# Altium schematic sheet SENSE MUXES.SchDoc: =DocumentName
size B
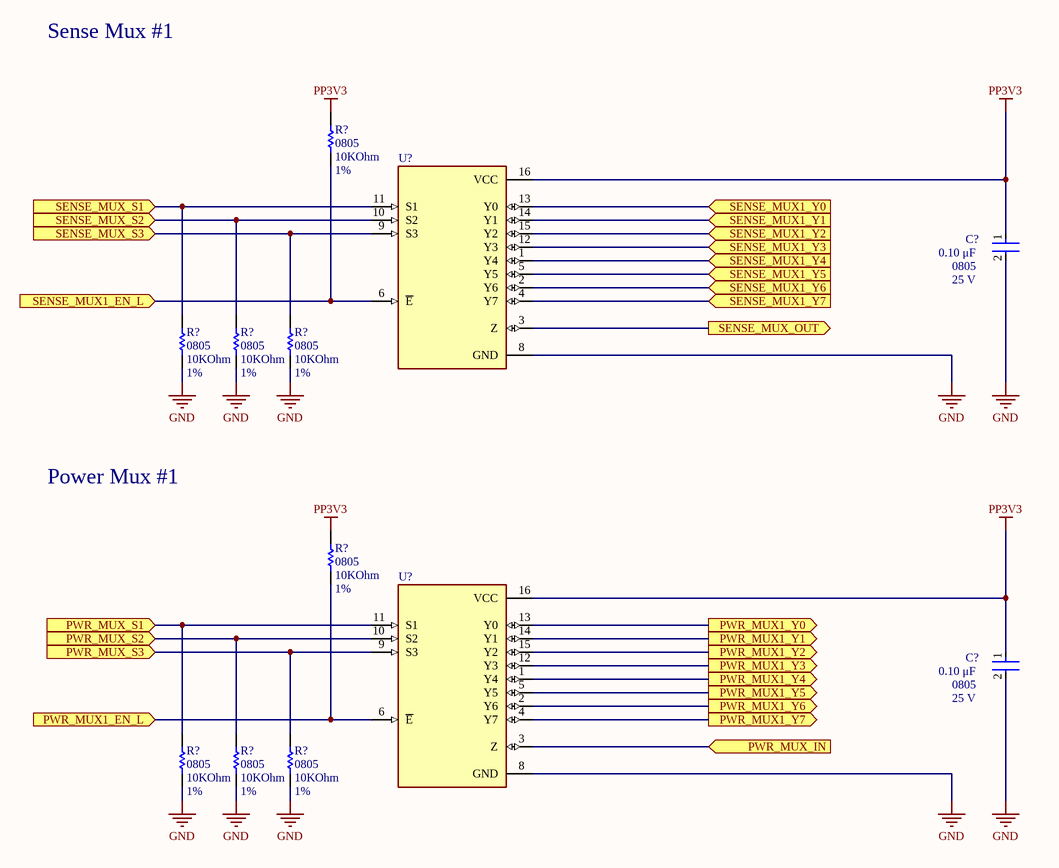
[diagram p0: SENSE MUXES.SchDoc]

## Parts
(Parts that share a designator on the sheet are numbered #1, #2 ... from top to bottom, then left to right.)
C?#1  Capacitance: 0.10 μF  Package: 0805  Voltage Rating: 25 V  [FP-C0805C-DN-MFG]  (hidden comment: C0805C104M3RACTU)
C?#2  Capacitance: 0.10 μF  Package: 0805  Voltage Rating: 25 V  [FP-C0805C-DN-MFG]  (hidden comment: C0805C104M3RACTU)
R?#1  value 10KOhm  Package Reference: 0805  Tolerance: 1%  [RESC2013X50X30NL20T20]  (hidden comment: CRCW080515K0FKTA)
R?#2  value 10KOhm  Package Reference: 0805  Tolerance: 1%  [RESC2013X50X30NL20T20]  (hidden comment: CRCW080515K0FKTA)
R?#3  value 10KOhm  Package Reference: 0805  Tolerance: 1%  [RESC2013X50X30NL20T20]  (hidden comment: CRCW080515K0FKTA)
R?#4  value 10KOhm  Package Reference: 0805  Tolerance: 1%  [RESC2013X50X30NL20T20]  (hidden comment: CRCW080515K0FKTA)
R?#5  value 10KOhm  Package Reference: 0805  Tolerance: 1%  [RESC2013X50X30NL20T20]  (hidden comment: CRCW080515K0FKTA)
R?#6  value 10KOhm  Package Reference: 0805  Tolerance: 1%  [RESC2013X50X30NL20T20]  (hidden comment: CRCW080515K0FKTA)
R?#7  value 10KOhm  Package Reference: 0805  Tolerance: 1%  [RESC2013X50X30NL20T20]  (hidden comment: CRCW080515K0FKTA)
R?#8  value 10KOhm  Package Reference: 0805  Tolerance: 1%  [RESC2013X50X30NL20T20]  (hidden comment: CRCW080515K0FKTA)
U?#1  NX3L4051PW,118  [SOP65P640X110-16N - duplicate]  (value not drawn)
U?#2  NX3L4051PW,118  [SOP65P640X110-16N - duplicate]  (value not drawn)

## Ports
PWR_MUX1_EN_L (in), PWR_MUX1_Y0 (out), PWR_MUX1_Y1 (out), PWR_MUX1_Y2 (out), PWR_MUX1_Y3 (out), PWR_MUX1_Y4 (out), PWR_MUX1_Y5 (out), PWR_MUX1_Y6 (out), PWR_MUX1_Y7 (out), PWR_MUX_IN (in), PWR_MUX_S1 (in), PWR_MUX_S2 (in), PWR_MUX_S3 (in), SENSE_MUX1_EN_L (in), SENSE_MUX1_Y0 (in), SENSE_MUX1_Y1 (in), SENSE_MUX1_Y2 (in), SENSE_MUX1_Y3 (in), SENSE_MUX1_Y4 (in), SENSE_MUX1_Y5 (in), SENSE_MUX1_Y6 (in), SENSE_MUX1_Y7 (in), SENSE_MUX_OUT (out), SENSE_MUX_S1 (in), SENSE_MUX_S2 (in), SENSE_MUX_S3 (in)

## Nets
GND: C?#1.2 C?#2.2 R?#2.1 R?#3.1 R?#4.1 R?#6.1 R?#7.1 R?#8.1 U?#1.8(GND) U?#2.8(GND)
PP3V3: C?#1.1 C?#2.1 R?#1.2 R?#5.2 U?#1.16(VCC) U?#2.16(VCC)
PWR_MUX1_EN_L: R?#5.1 U?#2.6(~{E}) ; port PWR_MUX1_EN_L
PWR_MUX1_Y0: U?#2.13(Y0) ; port PWR_MUX1_Y0
PWR_MUX1_Y1: U?#2.14(Y1) ; port PWR_MUX1_Y1
PWR_MUX1_Y2: U?#2.15(Y2) ; port PWR_MUX1_Y2
PWR_MUX1_Y3: U?#2.12(Y3) ; port PWR_MUX1_Y3
PWR_MUX1_Y4: U?#2.1(Y4) ; port PWR_MUX1_Y4
PWR_MUX1_Y5: U?#2.5(Y5) ; port PWR_MUX1_Y5
PWR_MUX1_Y6: U?#2.2(Y6) ; port PWR_MUX1_Y6
PWR_MUX1_Y7: U?#2.4(Y7) ; port PWR_MUX1_Y7
PWR_MUX_IN: U?#2.3(Z) ; port PWR_MUX_IN
PWR_MUX_S1: R?#6.2 U?#2.11(S1) ; port PWR_MUX_S1
PWR_MUX_S2: R?#7.2 U?#2.10(S2) ; port PWR_MUX_S2
PWR_MUX_S3: R?#8.2 U?#2.9(S3) ; port PWR_MUX_S3
SENSE_MUX1_EN_L: R?#1.1 U?#1.6(~{E}) ; port SENSE_MUX1_EN_L
SENSE_MUX1_Y0: U?#1.13(Y0) ; port SENSE_MUX1_Y0
SENSE_MUX1_Y1: U?#1.14(Y1) ; port SENSE_MUX1_Y1
SENSE_MUX1_Y2: U?#1.15(Y2) ; port SENSE_MUX1_Y2
SENSE_MUX1_Y3: U?#1.12(Y3) ; port SENSE_MUX1_Y3
SENSE_MUX1_Y4: U?#1.1(Y4) ; port SENSE_MUX1_Y4
SENSE_MUX1_Y5: U?#1.5(Y5) ; port SENSE_MUX1_Y5
SENSE_MUX1_Y6: U?#1.2(Y6) ; port SENSE_MUX1_Y6
SENSE_MUX1_Y7: U?#1.4(Y7) ; port SENSE_MUX1_Y7
SENSE_MUX_OUT: U?#1.3(Z) ; port SENSE_MUX_OUT
SENSE_MUX_S1: R?#2.2 U?#1.11(S1) ; port SENSE_MUX_S1
SENSE_MUX_S2: R?#3.2 U?#1.10(S2) ; port SENSE_MUX_S2
SENSE_MUX_S3: R?#4.2 U?#1.9(S3) ; port SENSE_MUX_S3

## Notes on the sheet
- Sense Mux #1
- Power Mux #1
- Title
- Size:
- Date:
- B
- Number:
- Time:
- Revision:
- Sheet
- of
- File:

## Library data of the parts
C?#1 C?#2 = CMP-2007-00282-2: CAP CER 0.1UF 25V 20% X7R 0805; Manufacturer: KEMET; Temperature Coefficient: 30ppm/°C; Material: Ceramic; Tolerance: 0.2; Value: 0.10 μF; Digikey Description: CAP CER 0.1UF 25V 20% X7R 0805; Device Class L2: Capacitors; Temperature: -55°C to +125°C; Device Class L1: Passive Components; ComponentLink2Description: Datasheet; Mouser Description: Multilayer Ceramic Capacitors MLCC - SMD/SMT 25volts 0.1uF X7R 20%; Temperature Range High: +125°C; Device Class L3: Ceramic Capacitors; Automotive: No; Temperature Range Low: -55°C; RoHS: TRUE; Category: Cap; Lead Free: Yes; Ipc Land Pattern Name: CAPC200125X78; Height: 0.88mm; Temperature Characteristic: X7R; Octopart: https://octopart.com/c0805c104m3ractu-kemet-9138612; ComponentLink2URL: https://content.kemet.com/datasheets/KEM_C1003_C0G_SMD.pdf; Manufacturer Part Number: C0805C104M3RACTU; Supplier: Digi-Key; Supplier Part Number: 399-C0805C104M3RAC7800CT-ND
R?#1-R?#8 = CMP-2001-04968-1: Manufacturer: Vishay Dale; Manufacturer Part Number: CRCW080515K0FKTA; Supplier: Digi-Key; Supplier Part Number: 541-3019-1-ND
U?#1 U?#2 = NX3L4051PW,118: 1 Circuit IC Switch 8:1 750mOhm 16-TSSOP; Manufacturer: NXP USA Inc.; MF: NXP USA; Check_prices: https://www.snapeda.com/parts/NX3L4051PW,118/NXP%20USA%20Inc./view-part/648693/?ref=eda; SnapEDA_Link: https://www.snapeda.com/parts/NX3L4051PW,118/NXP%20USA%20Inc./view-part/648693/?ref=snap; Package: TSSOP-16 NXP USA; MP: NX3L4051PW,118; Value: *; Digi-Key_Part_Number: 568-12393-1-ND; Purchase-URL: https://pricing.snapeda.com/search/part/NX3L4051PW,118/?ref=eda; Manufacturer Part Number: NX3L4051PW,118; Supplier: Digi-Key; Supplier Part Number: 568-12393-1-ND